# EAGLE schematic OpenBlink (EAGLE 6.3)
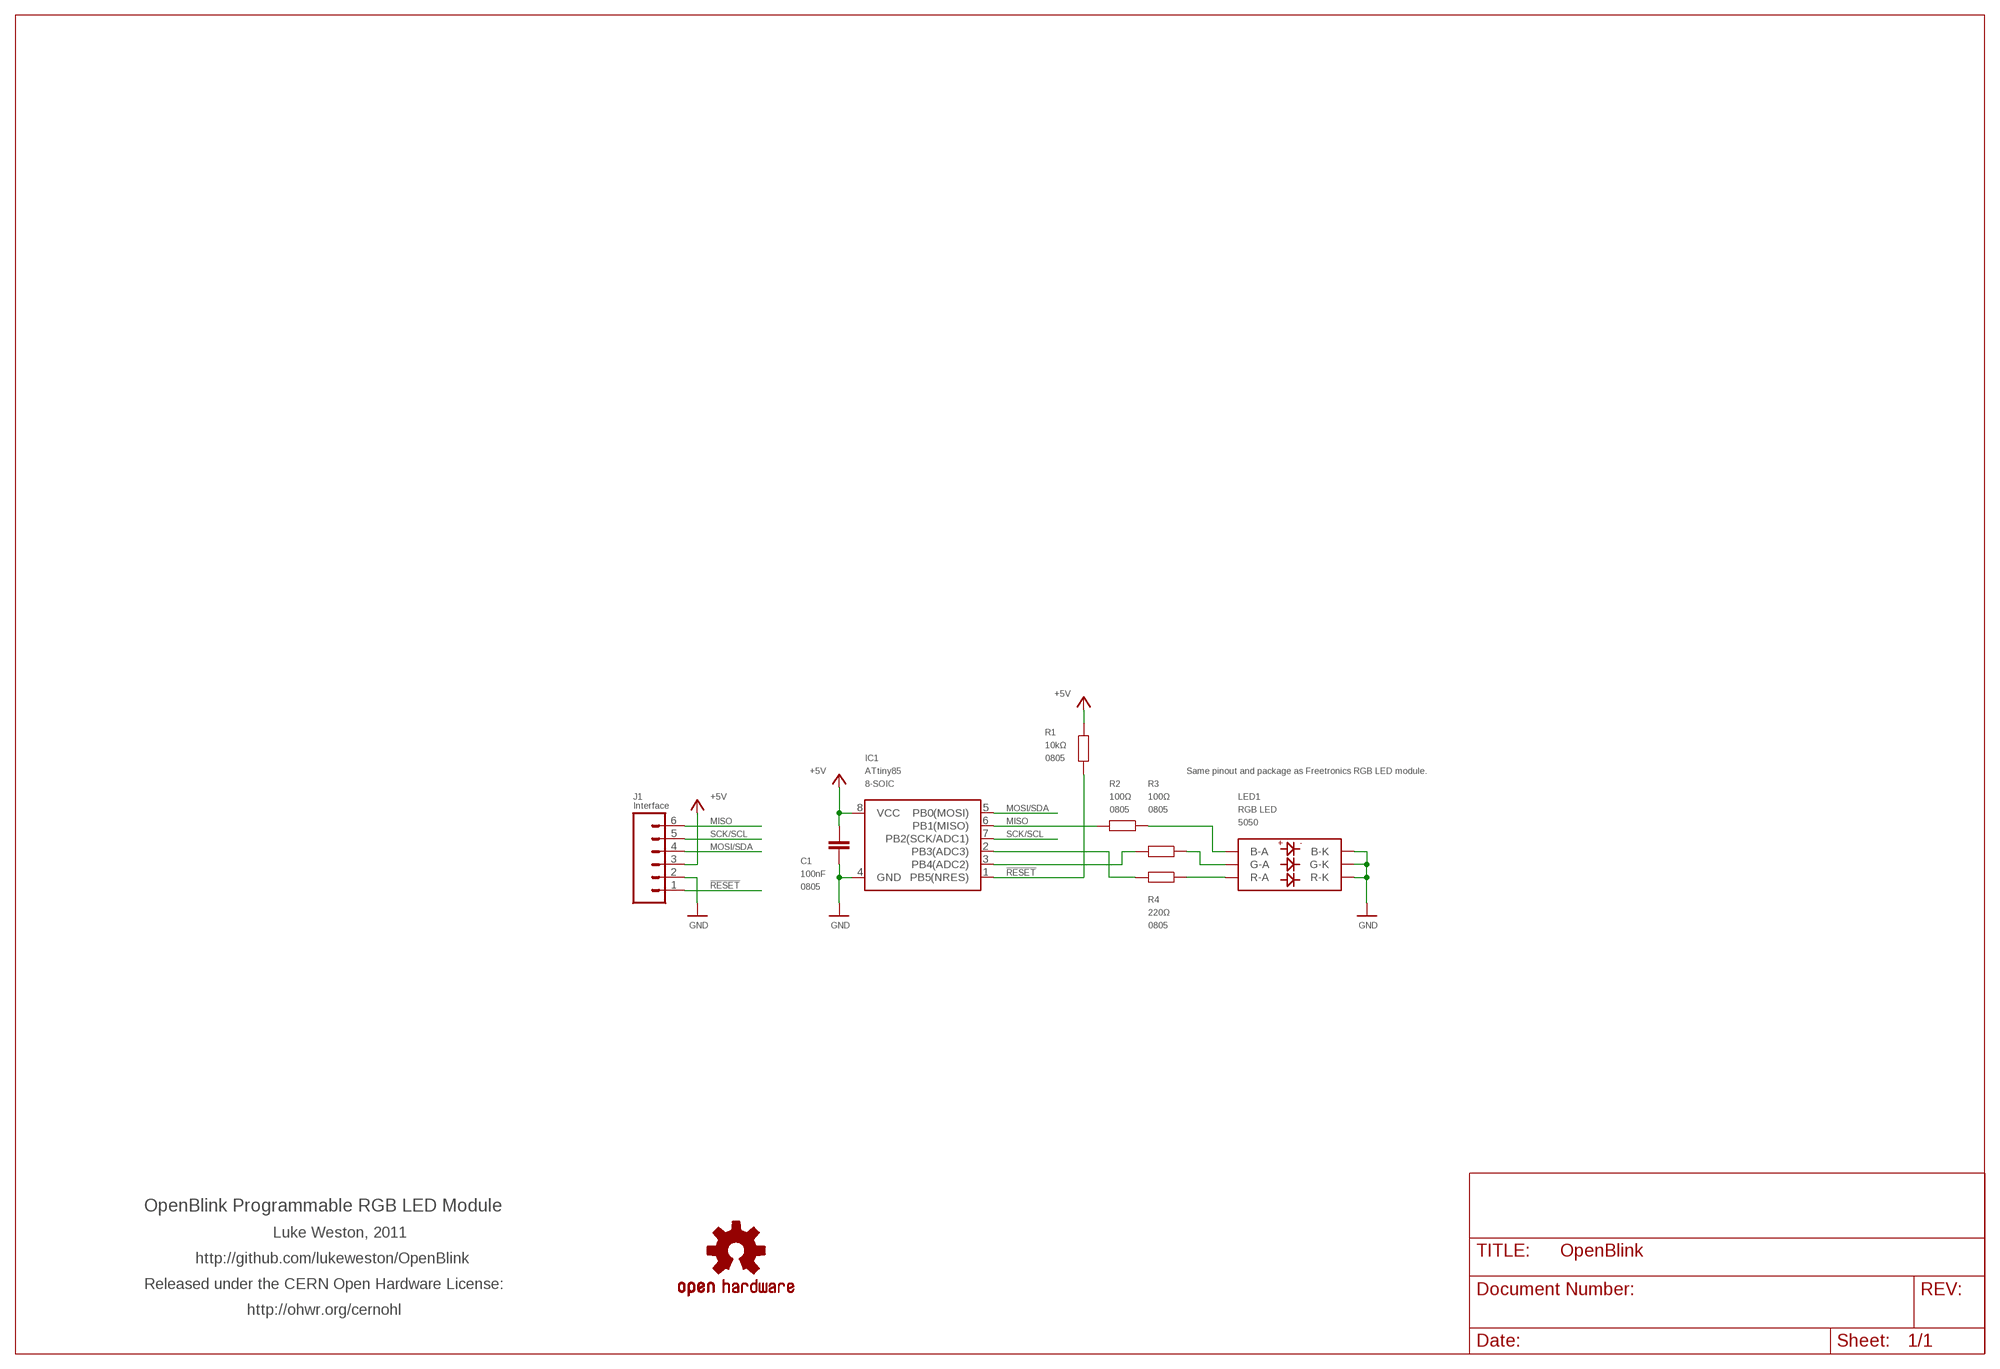
[diagram p0: schematic, sheet 1]

## Parts
C1  100nF  CAP0805  [0805]
IC1  ATtiny85  ATTINY45  [SO08-EIAJ]
J1  Interface  M06SIP  [1X06]
LED1  RGB LED  LED-RGB-50505050  [LED-RGB-5050]
R1  10kΩ  RESISTOR0805  [0805]
R2  100Ω  RESISTOR0805  [0805]
R3  100Ω  RESISTOR0805  [0805]
R4  220Ω  RESISTOR0805  [0805]
SY  OSHW-LOGOS  [OSHW-LOGO-S]

## Nets
!RESET: IC1.1(PB5(NRES)) J1.1 R1.1
+5V: C1.1 IC1.8(VCC) J1.3 R1.2
GND: C1.2 IC1.4(GND) J1.2 LED1.BK(B-K) LED1.GK(G-K) LED1.RK(R-K)
MISO: IC1.6(PB1(MISO)) J1.6 R2.2
MOSI/SDA: IC1.5(PB0(MOSI)) J1.4
N$2: IC1.2(PB3(ADC3)) R4.2
N$3: IC1.3(PB4(ADC2)) R3.2
N$4: LED1.RA(R-A) R4.1
N$5: LED1.GA(G-A) R3.1
N$6: LED1.BA(B-A) R2.1
SCK/SCL: IC1.7(PB2(SCK/ADC1)) J1.5

## Notes on the sheet
- Same pinout and package as Freetronics RGB LED module.
- OpenBlink Programmable RGB LED Module
- Luke Weston, 2011
- http://github.com/lukeweston/OpenBlink
- Released under the CERN Open Hardware License:
- http://ohwr.org/cernohl

## Library data of the parts
C1 = freetronics-master-v1:CAP: Capacitor Standard 0603 ceramic capacitor, and 0.1" leaded capacitor.; PACKAGE: 0805
IC1 = SparkFun:ATTINY45: Atmel ATTiny45; PACKAGE: 8-SOIC
J1 = freetronics-master-v1:M06: Header 6 Standard 6-pin 0.1" header. Use with straight break away headers (SKU : PRT-00116), right angle break away headers (PRT-00553), swiss pins (PRT-00743), machine pins (PRT-00117), and female headers (PRT-00115). Molex polarized connector foot print use with SKU : PRT-08094 with associated crimp pins and housings. NOTES ON THE VARIANTS LOCK and LOCK_LONGPADS... This footprint was designed to help hold the alignment of a through-hole component (i.e. 6-pin header) while soldering it into place. You may notice that each hole has been shifted either up or down by 0.005 of an inch from it's more standard position (which is a perfectly straight line). This slight alteration caused the pins (the squares in the middle) to touch the edges of the holes. Because they are alternating, it causes a "brace" to hold the component in place. 0.005 has proven to be the perfect amount of "off-center" position when using our standard breakaway headers. Although looks a little odd when you look at the bare footprint, once you have a header in there, the alteration is very hard to notice. Also, if you push a header all the way into place, it is covered up entirely on the bottom side. This idea of altering the position of holes to aid alignment will be further integrated into the Sparkfun Library for other footprints. It can help hold any component with 3 or more connection pins.
LED1 = freetronics-master-v1:LED-RGB-5050; PACKAGE: 5050
R1-R4 = freetronics-master-v1:RESISTOR: Resistor Basic schematic elements and footprints for 0603, 1206, and PTH 1/10th watt (small) resistors.; PACKAGE: 0805
SY = SparkFun:OSHW-LOGO: Open Source Hardware Logo This logo indicates the piece of hardware it is found on incorporates a OSHW license and/or adheres to the definition of open source hardware found here: http://freedomdefined.org/OSHW